# Altium project MatriXDeck.PrjPcb
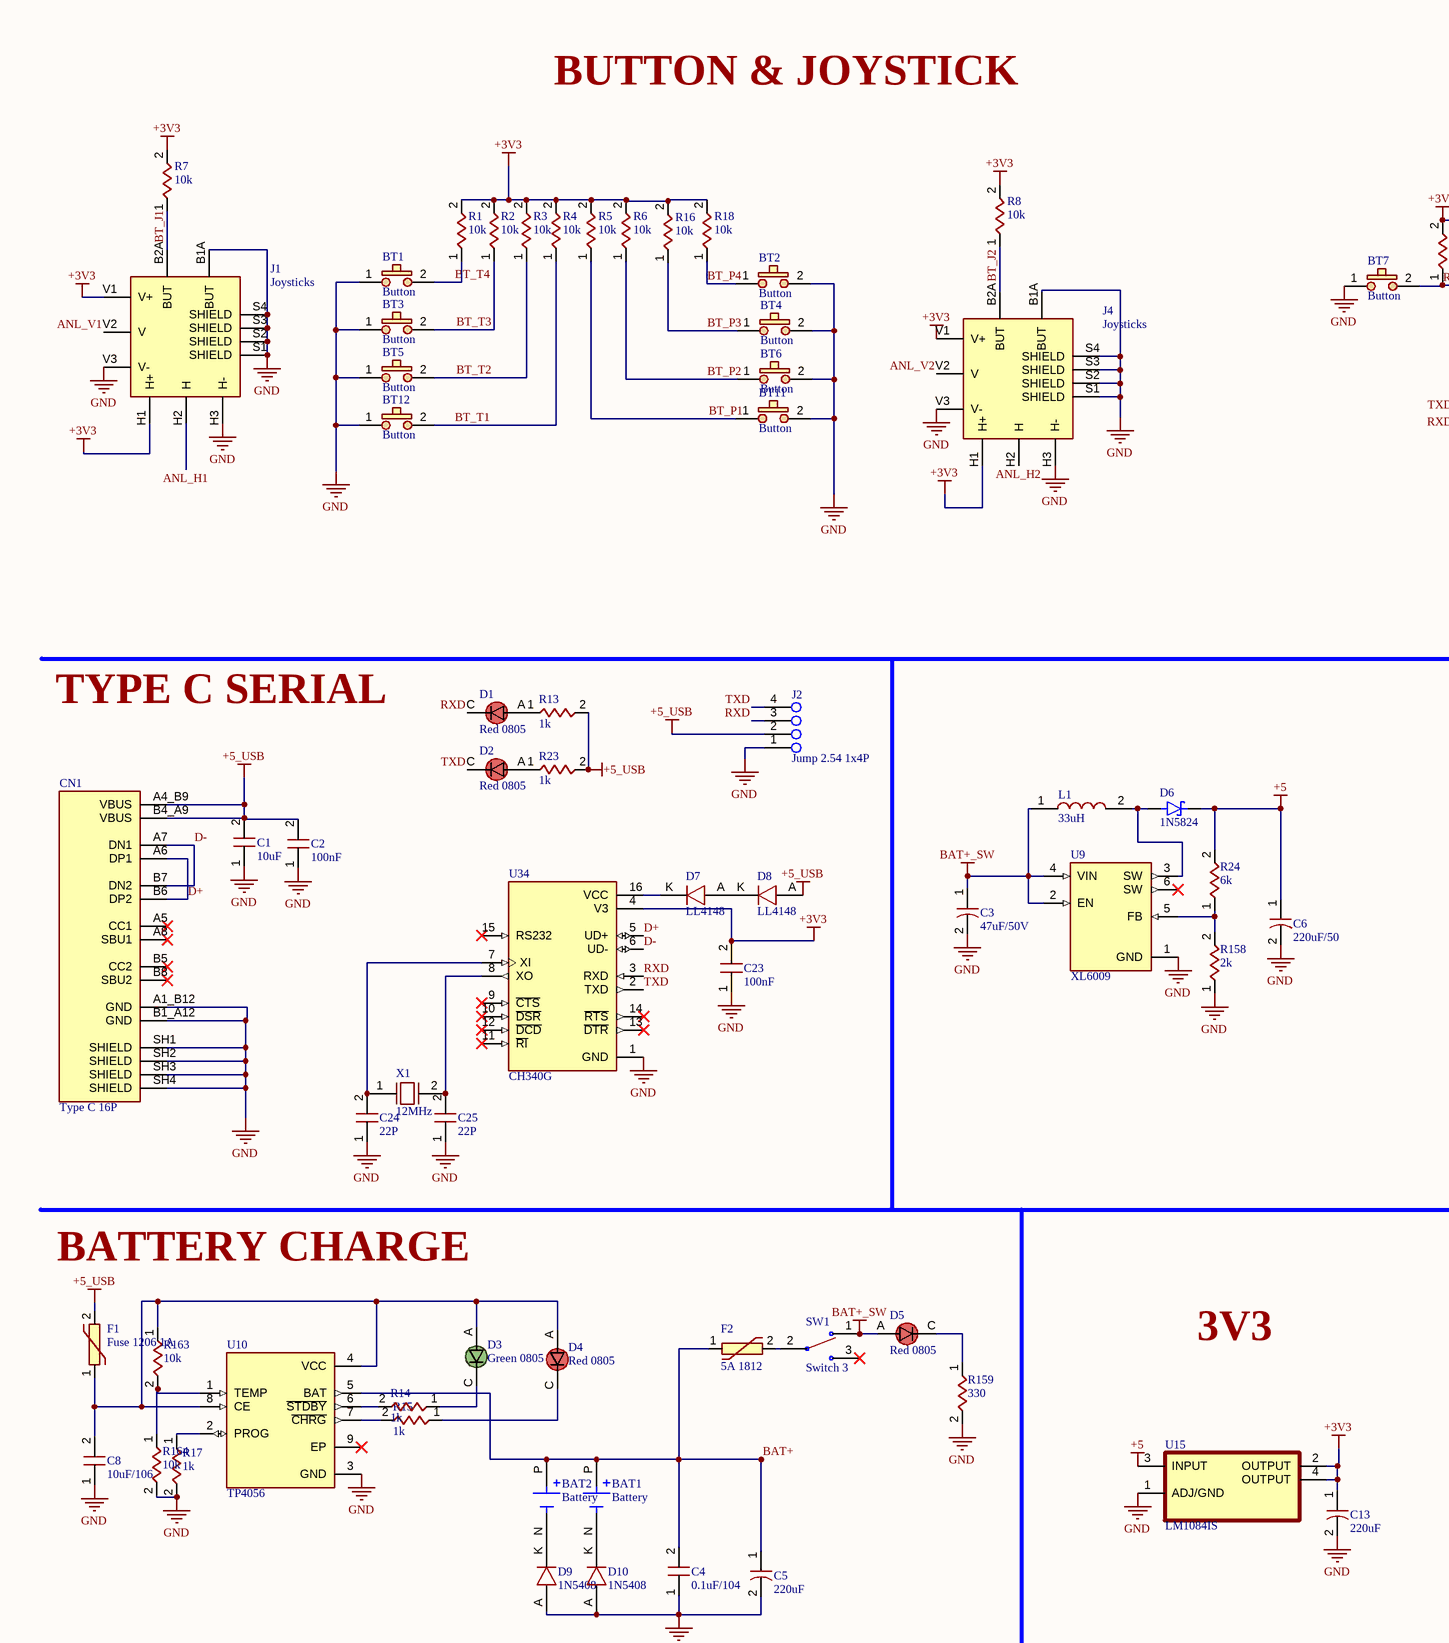
[diagram p0: MatriXDeck.SchDoc, top left]
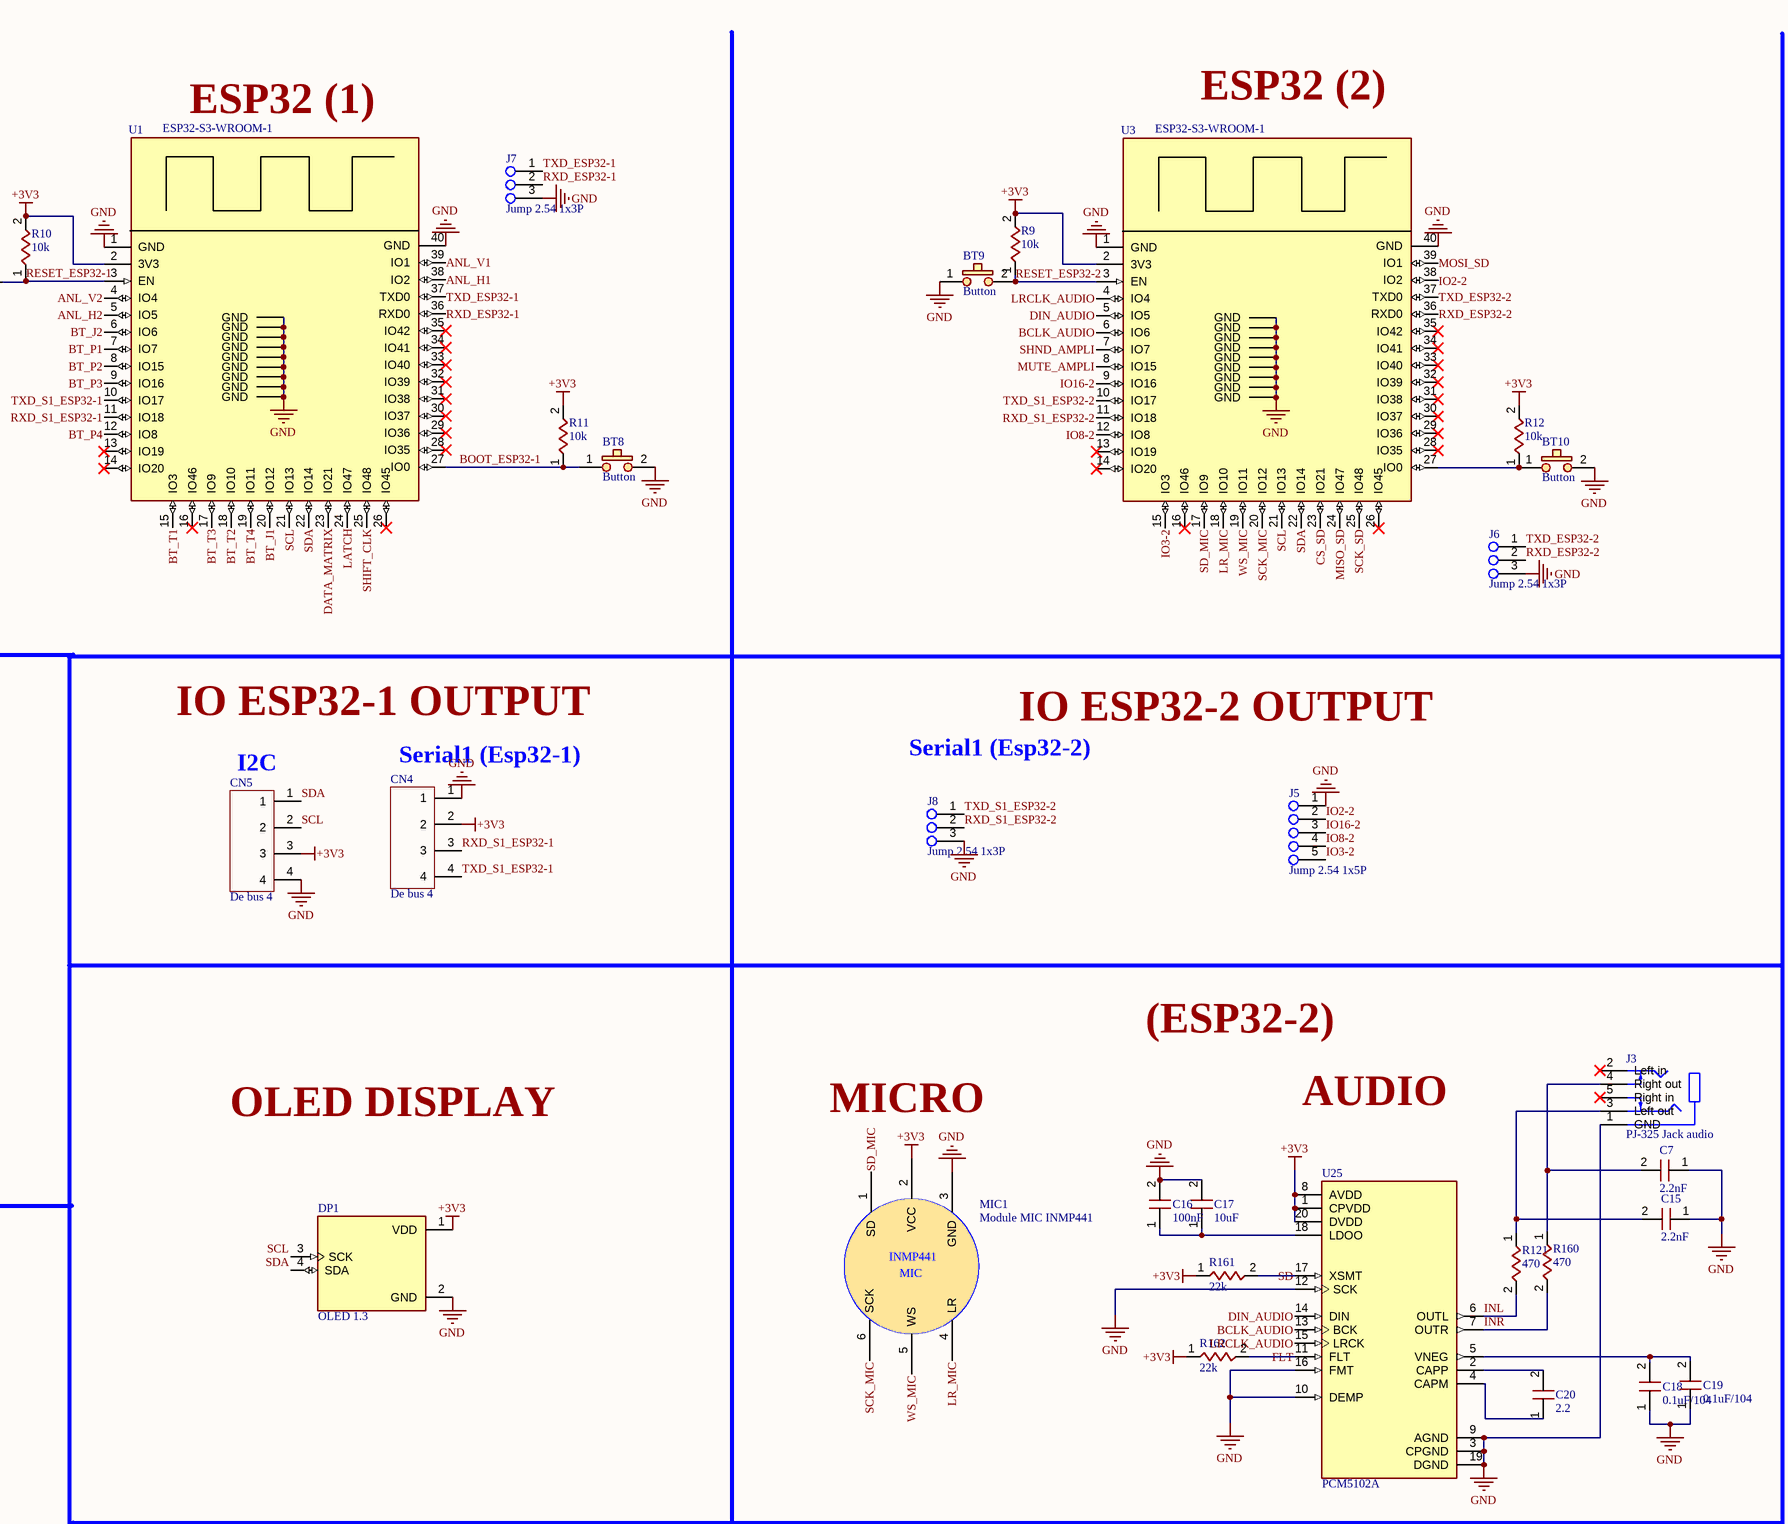
[diagram p1: MatriXDeck.SchDoc, top middle]
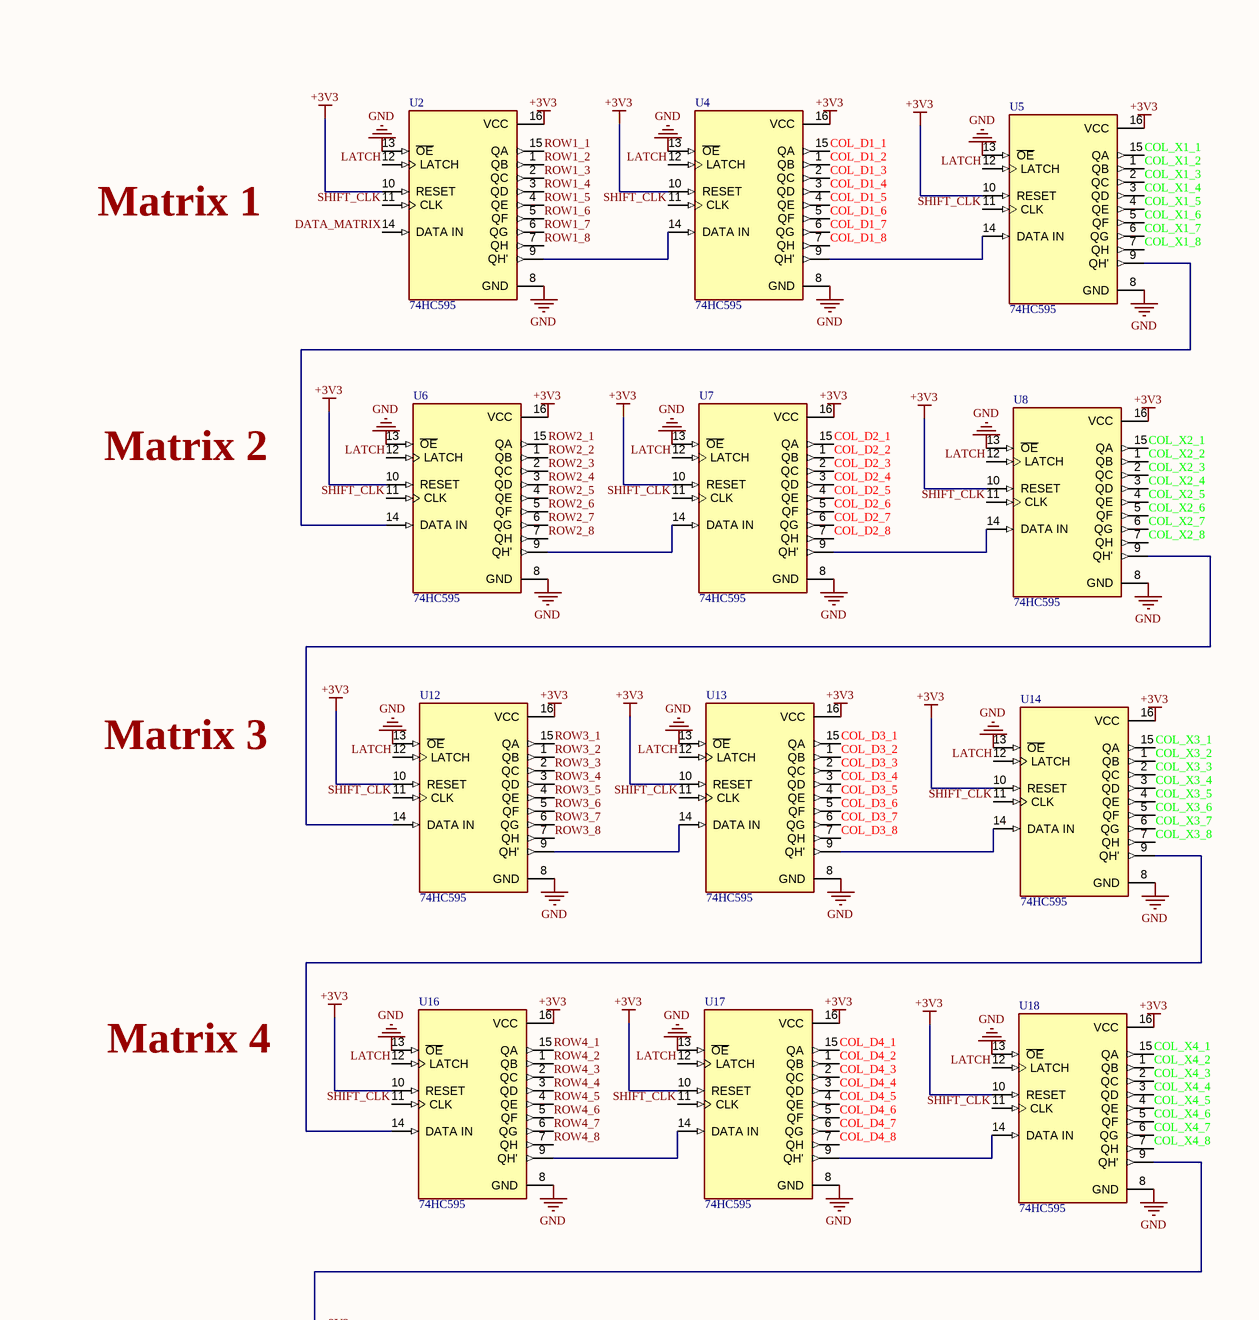
[diagram p2: MatriXDeck.SchDoc, top right]
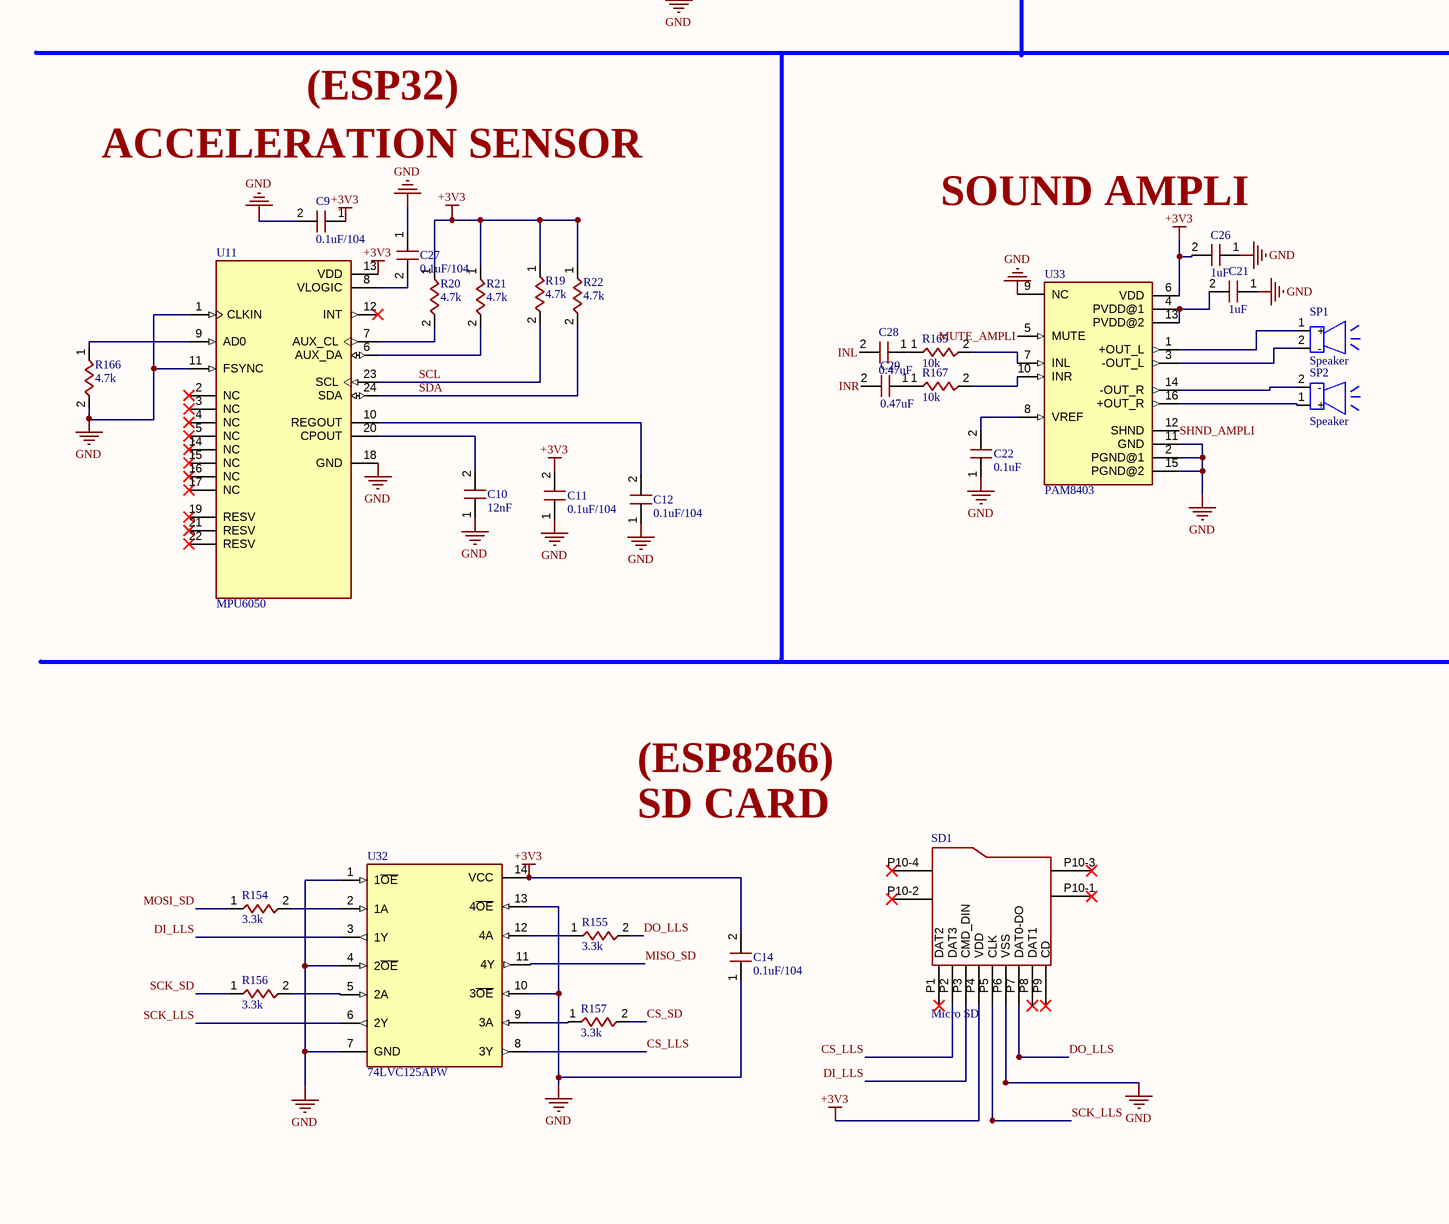
[diagram p3: MatriXDeck.SchDoc, bottom left]
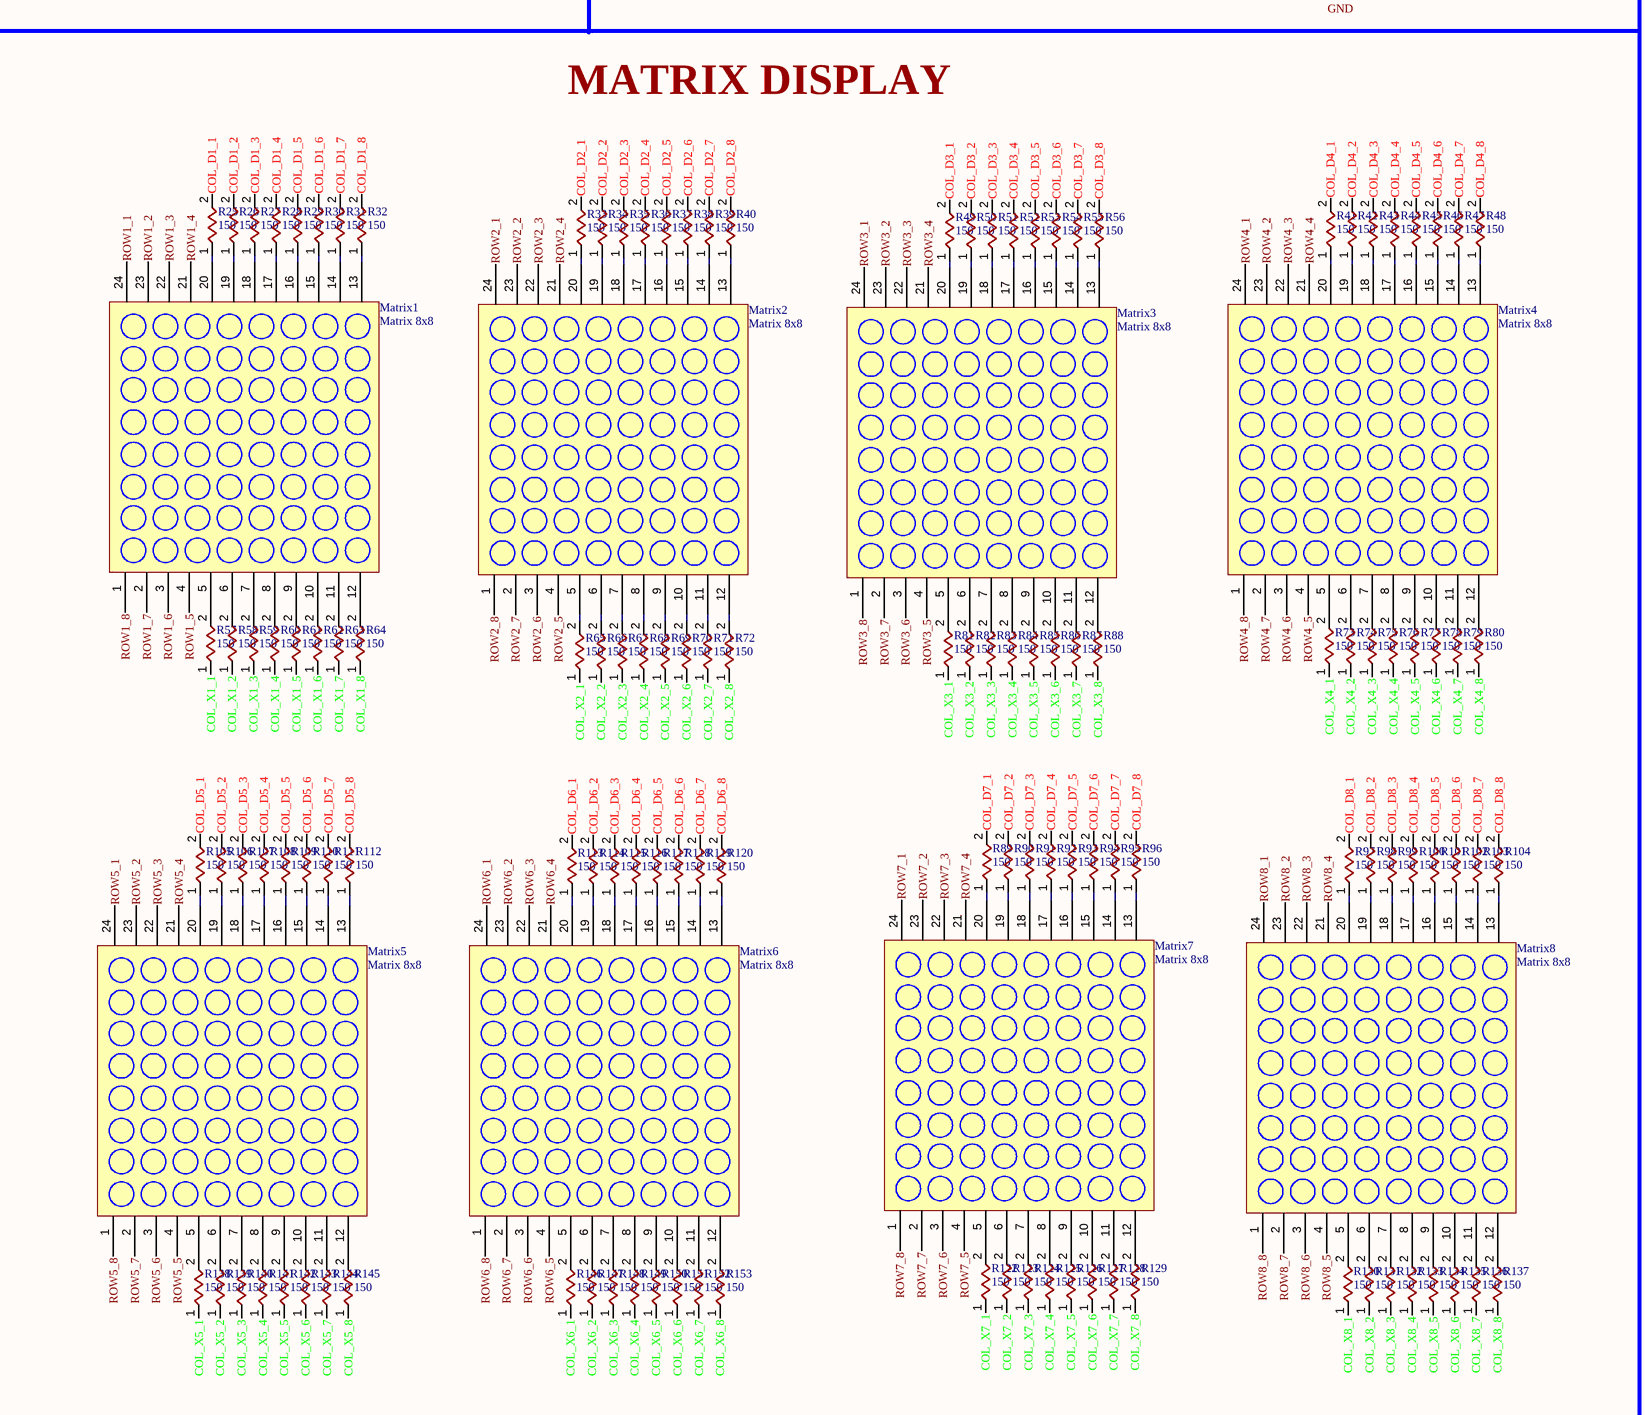
[diagram p4: MatriXDeck.SchDoc, bottom middle]
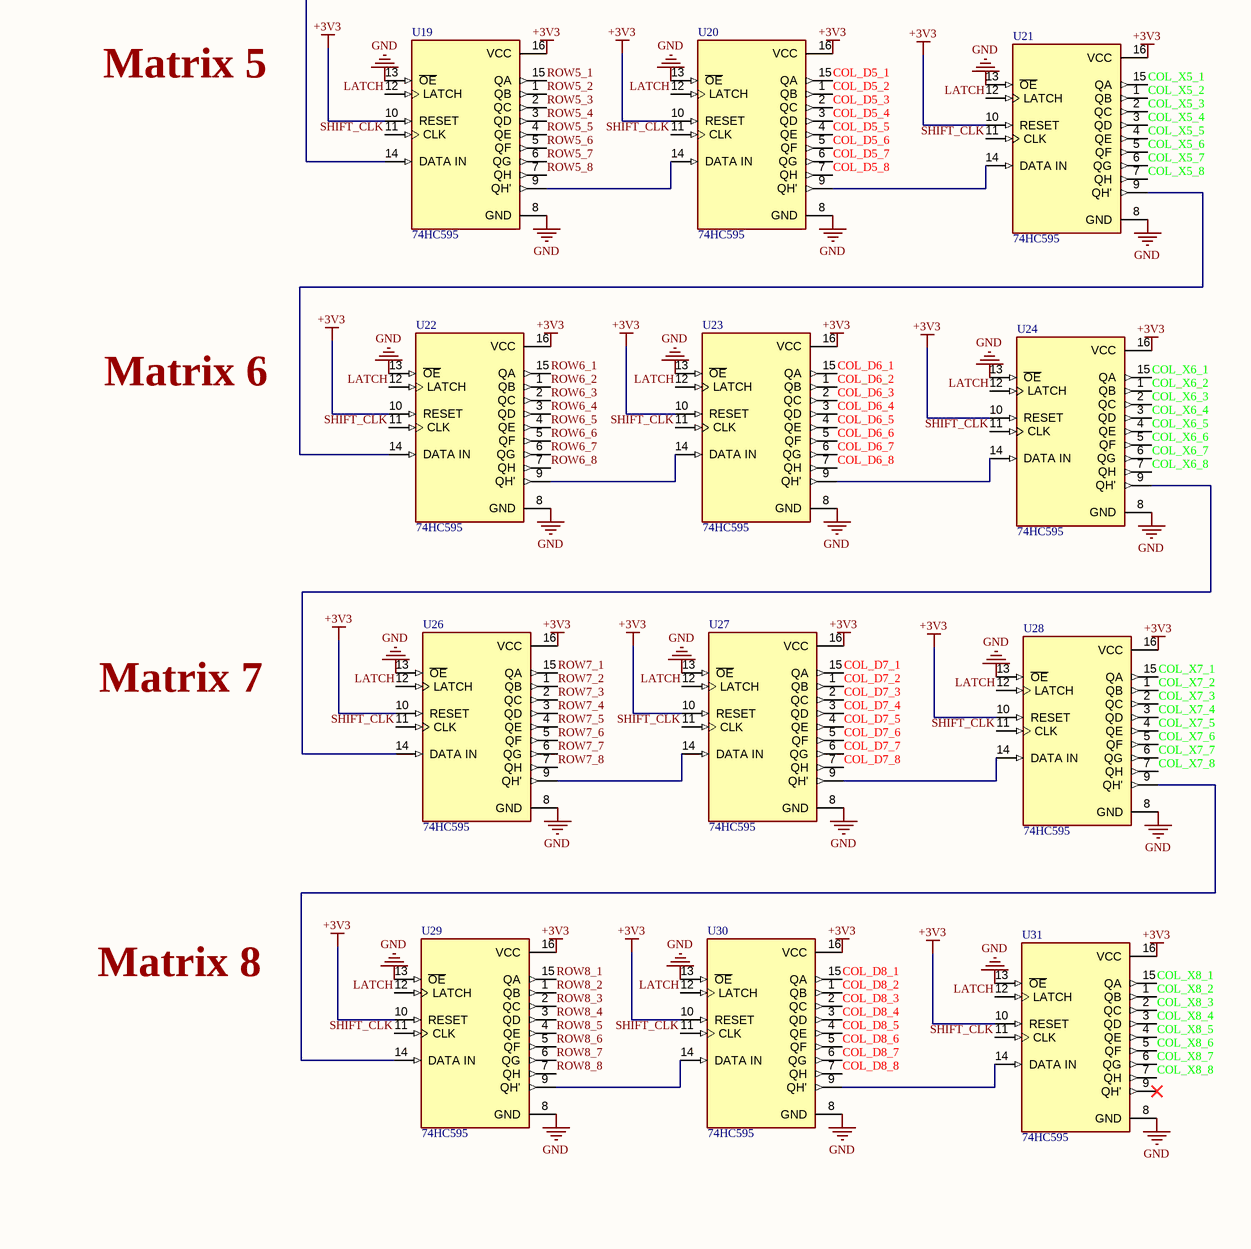
[diagram p5: MatriXDeck.SchDoc, bottom right]
1 sheet, 283 parts. Net scope: global (net labels, ports and power ports of the same name join across sheets).
Board file: MatrixDeck_Final.PcbDoc

## Sheet MatriXDeck.SchDoc
size 863 x 558 mm; SheetNumber: 1; SheetTotal: 1

### Parts
BAT1  Battery  [16850 SMD]
BAT2  Battery  [16850 SMD]
BT1  Button  [BT 12x12 SMD]
BT2  Button  [BT 12x12 SMD]
BT3  Button  [BT 12x12 SMD]
BT4  Button  [BT 12x12 SMD]
BT5  Button  [BT 12x12 SMD]
BT6  Button  [BT 12x12 SMD]
BT7  Button  [BT 6x4mm]
BT8  Button  [BT 6x4mm]
BT9  Button  [BT 6x4mm]
BT10  Button  [BT 6x4mm]
BT11  Button  [BT 12x12 SMD]
BT12  Button  [BT 12x12 SMD]
C1  10uF  [CAP 0805]
C2  100nF  [CAP 0805]
C3  47uF/50V  [Cap Alu 6.3x7.7]
C4  0.1uF/104  [CAP 0805]
C5  220uF  [Cap Alu 6.3x7.7]
C6  220uF/50  [Cap Alu 6.3x7.7]
C7  2.2nF  [CAP 0805]
C8  10uF/106  [CAP 0805]
C9  0.1uF/104  [CAP 0805]
C10  12nF  [CAP 0805]
C11  0.1uF/104  [CAP 0805]
C12  0.1uF/104  [CAP 0805]
C13  220uF  [Cap Alu 6.3x7.7]
C14  0.1uF/104  [CAP 0805]
C15  2.2nF  [CAP 0805]
C16  100nF  [CAP 0805]
C17  10uF  [CAP 0805]
C18  0.1uF/104  [CAP 0805]
C19  0.1uF/104  [CAP 0805]
C20  2.2  [CAP 0805]
C21  1uF  [CAP 0805]
C22  0.1uF  [CAP 0805]
C23  100nF  [CAP 0805]
C24  22P  [CAP 0805]
C25  22P  [CAP 0805]
C26  1uF  [CAP 0805]
C27  0.1uF/104  [CAP 0805]
C28  0.47uF  [CAP 0805]
C29  0.47uF  [CAP 0805]
CN1  Type C 16P  [Type C 16P]
CN4  De bus 4  [De bus 4]
CN5  De bus 4  [De bus 4]
D1  Red 0805  [LED RED 0805]
D2  Red 0805  [LED RED 0805]
D3  Green 0805  [LED GREEN 0805]
D4  Red 0805  [LED RED 0805]
D5  Red 0805  [LED RED 0805]
D6  1N5824  [DO-214AC (SMA)]
D7  LL4148  [DIO_LL4148]
D8  LL4148  [DIO_LL4148]
D9  1N5408  [S3M]
D10  1N5408  [S3M]
DP1  OLED 1.3  [Display OLED 1.3]
F1  Fuse 1206 1A  [Fuse 1206]
F2  5A 1812  [FUSE1812]
J1  Joysticks  [Joysticks]
J2  Jump 2.54 1x4P  [Jump 2.54 1x4P duc thang]
J3  PJ-325 Jack audio  [Jack audio PJ-325]
J4  Joysticks  [Joysticks]
J5  Jump 2.54 1x5P  [Jump 2.54 1x5P duc thang]
J6  Jump 2.54 1x3P  [Jump 2.54 1x3P duc thang]
J7  Jump 2.54 1x3P  [Jump 2.54 1x3P duc thang]
J8  Jump 2.54 1x3P  [Jump 2.54 1x3P duc thang]
L1  33uH  [Inductor 12x12 smd]
Matrix1  Matrix 8x8  [Matrix 8x8 2 color]
Matrix2  Matrix 8x8  [Matrix 8x8 2 color]
Matrix3  Matrix 8x8  [Matrix 8x8 2 color]
Matrix4  Matrix 8x8  [Matrix 8x8 2 color]
Matrix5  Matrix 8x8  [Matrix 8x8 2 color]
Matrix6  Matrix 8x8  [Matrix 8x8 2 color]
Matrix7  Matrix 8x8  [Matrix 8x8 2 color]
Matrix8  Matrix 8x8  [Matrix 8x8 2 color]
MIC1  Module MIC INMP441  [Module Mic INMP441]
R1  10k  [RES 0805]
R2  10k  [RES 0805]
R3  10k  [RES 0805]
R4  10k  [RES 0805]
R5  10k  [RES 0805]
R6  10k  [RES 0805]
R7  10k  [RES 0805]
R8  10k  [RES 0805]
R9  10k  [RES 0805]
R10  10k  [RES 0805]
R11  10k  [RES 0805]
R12  10k  [RES 0805]
R13  1k  [RES 0805]
R14  1k  [RES 0805]
R15  1k  [RES 0805]
R16  10k  [RES 0805]
R17  1k  [RES 0805]
R18  10k  [RES 0805]
R19  4.7k  [RES 0805]
R20  4.7k  [RES 0805]
R21  4.7k  [RES 0805]
R22  4.7k  [RES 0805]
R23  1k  [RES 0805]
R24  6k  [RES 0805]
R25  150  [RES 0805]
R26  150  [RES 0805]
R27  150  [RES 0805]
R28  150  [RES 0805]
R29  150  [RES 0805]
R30  150  [RES 0805]
R31  150  [RES 0805]
R32  150  [RES 0805]
R33  150  [RES 0805]
R34  150  [RES 0805]
R35  150  [RES 0805]
R36  150  [RES 0805]
R37  150  [RES 0805]
R38  150  [RES 0805]
R39  150  [RES 0805]
R40  150  [RES 0805]
R41  150  [RES 0805]
R42  150  [RES 0805]
R43  150  [RES 0805]
R44  150  [RES 0805]
R45  150  [RES 0805]
R46  150  [RES 0805]
R47  150  [RES 0805]
R48  150  [RES 0805]
R49  150  [RES 0805]
R50  150  [RES 0805]
R51  150  [RES 0805]
R52  150  [RES 0805]
R53  150  [RES 0805]
R54  150  [RES 0805]
R55  150  [RES 0805]
R56  150  [RES 0805]
R57  150  [RES 0805]
R58  150  [RES 0805]
R59  150  [RES 0805]
R60  150  [RES 0805]
R61  150  [RES 0805]
R62  150  [RES 0805]
R63  150  [RES 0805]
R64  150  [RES 0805]
R65  150  [RES 0805]
R66  150  [RES 0805]
R67  150  [RES 0805]
R68  150  [RES 0805]
R69  150  [RES 0805]
R70  150  [RES 0805]
R71  150  [RES 0805]
R72  150  [RES 0805]
R73  150  [RES 0805]
R74  150  [RES 0805]
R75  150  [RES 0805]
R76  150  [RES 0805]
R77  150  [RES 0805]
R78  150  [RES 0805]
R79  150  [RES 0805]
R80  150  [RES 0805]
R81  150  [RES 0805]
R82  150  [RES 0805]
R83  150  [RES 0805]
R84  150  [RES 0805]
R85  150  [RES 0805]
R86  150  [RES 0805]
R87  150  [RES 0805]
R88  150  [RES 0805]
R89  150  [RES 0805]
R90  150  [RES 0805]
R91  150  [RES 0805]
R92  150  [RES 0805]
R93  150  [RES 0805]
R94  150  [RES 0805]
R95  150  [RES 0805]
R96  150  [RES 0805]
R97  150  [RES 0805]
R98  150  [RES 0805]
R99  150  [RES 0805]
R100  150  [RES 0805]
R101  150  [RES 0805]
R102  150  [RES 0805]
R103  150  [RES 0805]
R104  150  [RES 0805]
R105  150  [RES 0805]
R106  150  [RES 0805]
R107  150  [RES 0805]
R108  150  [RES 0805]
R109  150  [RES 0805]
R110  150  [RES 0805]
R111  150  [RES 0805]
R112  150  [RES 0805]
R113  150  [RES 0805]
R114  150  [RES 0805]
R115  150  [RES 0805]
R116  150  [RES 0805]
R117  150  [RES 0805]
R118  150  [RES 0805]
R119  150  [RES 0805]
R120  150  [RES 0805]
R121  470  [RES 0805]
R122  150  [RES 0805]
R123  150  [RES 0805]
R124  150  [RES 0805]
R125  150  [RES 0805]
R126  150  [RES 0805]
R127  150  [RES 0805]
R128  150  [RES 0805]
R129  150  [RES 0805]
R130  150  [RES 0805]
R131  150  [RES 0805]
R132  150  [RES 0805]
R133  150  [RES 0805]
R134  150  [RES 0805]
R135  150  [RES 0805]
R136  150  [RES 0805]
R137  150  [RES 0805]
R138  150  [RES 0805]
R139  150  [RES 0805]
R140  150  [RES 0805]
R141  150  [RES 0805]
R142  150  [RES 0805]
R143  150  [RES 0805]
R144  150  [RES 0805]
R145  150  [RES 0805]
R146  150  [RES 0805]
R147  150  [RES 0805]
R148  150  [RES 0805]
R149  150  [RES 0805]
R150  150  [RES 0805]
R151  150  [RES 0805]
R152  150  [RES 0805]
R153  150  [RES 0805]
R154  3.3k  [RES 0805]
R155  3.3k  [RES 0805]
R156  3.3k  [RES 0805]
R157  3.3k  [RES 0805]
R158  2k  [RES 0805]
R159  330  [RES 0805]
R160  470  [RES 0805]
R161  22k  [RES 0805]
R162  22k  [RES 0805]
R163  10k  [RES 0805]
R164  10k  [RES 0805]
R165  10k  [RES 0805]
R166  4.7k  [RES 0805]
R167  10k  [RES 0805]
SD1  Micro SD  [TF Micro SD]
SP1  Speaker  [Speaker 2W 35x25]
SP2  Speaker  [Speaker 2W 35x25]
SW1  Switch 3  [Switch 3P SK12D07VG4]
U1  ESP32-S3-WROOM-1  [ESP32-S3]
U2  74HC595  [SOIC-16]
U3  ESP32-S3-WROOM-1  [ESP32-S3]
U4  74HC595  [SOIC-16]
U5  74HC595  [SOIC-16]
U6  74HC595  [SOIC-16]
U7  74HC595  [SOIC-16]
U8  74HC595  [SOIC-16]
U9  XL6009  [TO-263-5L]
U10  TP4056  [ESOP8]
U11  MPU6050  [QFN-24]
U12  74HC595  [SOIC-16]
U13  74HC595  [SOIC-16]
U14  74HC595  [SOIC-16]
U15  LM1084IS  [TO-263]
U16  74HC595  [SOIC-16]
U17  74HC595  [SOIC-16]
U18  74HC595  [SOIC-16]
U19  74HC595  [SOIC-16]
U20  74HC595  [SOIC-16]
U21  74HC595  [SOIC-16]
U22  74HC595  [SOIC-16]
U23  74HC595  [SOIC-16]
U24  74HC595  [SOIC-16]
U25  PCM5102A  [TSSOP-20]
U26  74HC595  [SOIC-16]
U27  74HC595  [SOIC-16]
U28  74HC595  [SOIC-16]
U29  74HC595  [SOIC-16]
U30  74HC595  [SOIC-16]
U31  74HC595  [SOIC-16]
U32  74LVC125APW  [TSSOP-14]
U33  PAM8403  [SOP-16]
U34  CH340G  [CH340G]
X1  12MHz  [Crytal SMD]

### Nets
+3V3: C9.1 C11.2 C13.1 C14.2 C23.2 C26.2 CN4.2 CN5.3 DP1.1(VDD) J1.H1(H+) J1.V1(V+) J4.H1(H+) J4.V1(V+) MIC1.2(VCC) R1.2 R2.2 R3.2 R4.2 R5.2 R6.2 R7.2 R8.2 R9.2 R10.2 R11.2 R12.2 R16.2 R18.2 R19.1 R20.1 R21.1 R22.1 R161.1 R162.1 SD1.P4(VDD) U1.2(3V3) U2.10(RESET) U2.16(VCC) U3.2(3V3) U4.10(RESET) U4.16(VCC) U5.10(RESET) U5.16(VCC) U6.10(RESET) U6.16(VCC) U7.10(RESET) U7.16(VCC) U8.10(RESET) U8.16(VCC) U11.13(VDD) U12.10(RESET) U12.16(VCC) U13.10(RESET) U13.16(VCC) U14.10(RESET) U14.16(VCC) U15.2(OUTPUT) U15.4(OUTPUT) U16.10(RESET) U16.16(VCC) U17.10(RESET) U17.16(VCC) U18.10(RESET) U18.16(VCC) U19.10(RESET) U19.16(VCC) U20.10(RESET) U20.16(VCC) U21.10(RESET) U21.16(VCC) U22.10(RESET) U22.16(VCC) U23.10(RESET) U23.16(VCC) U24.10(RESET) U24.16(VCC) U25.1(CPVDD) U25.8(AVDD) U25.20(DVDD) U26.10(RESET) U26.16(VCC) U27.10(RESET) U27.16(VCC) U28.10(RESET) U28.16(VCC) U29.10(RESET) U29.16(VCC) U30.10(RESET) U30.16(VCC) U31.10(RESET) U31.16(VCC) U32.14(VCC) U33.6(VDD) U34.4(V3)
+5: C6.1 D6.K R24.2 U15.3(INPUT)
+5_USB: C1.2 C2.2 CN1.A4_B9(VBUS) CN1.B4_A9(VBUS) D8.A F1.2 J2.2 R13.2 R23.2
BAT+_SW: C3.1 D5.A L1.1 SW1.1 U9.2(EN) U9.4(VIN)
GND: BT1.1 BT2.2 BT3.1 BT4.2 BT5.1 BT6.2 BT7.1 BT8.2 BT9.1 BT10.2 BT11.2 BT12.1 C1.1 C2.1 C3.2 C4.1 C5.2 C6.2 C7.1 C8.1 C9.2 C10.1 C11.1 C12.1 C13.2 C14.1 C15.1 C16.2 C17.2 C18.1 C19.1 C21.1 C22.1 C23.1 C24.1 C25.1 C26.1 C27.1 CN1.A1_B12(GND) CN1.B1_A12(GND) CN1.SH1(SHIELD) CN1.SH2(SHIELD) CN1.SH3(SHIELD) CN1.SH4(SHIELD) CN4.1 CN5.4 D9.A D10.A DP1.2(GND) J1.B1A(BUT) J1.H3(H-) J1.S1(SHIELD) J1.S2(SHIELD) J1.S3(SHIELD) J1.S4(SHIELD) J1.V3(V-) J2.1 J3.1(GND) J4.B1A(BUT) J4.H3(H-) J4.S1(SHIELD) J4.S2(SHIELD) J4.S3(SHIELD) J4.S4(SHIELD) J4.V3(V-) J5.1 J6.3 J7.3 J8.3 MIC1.3(GND) R17.2 R158.1 R159.2 R164.2 R166.2 SD1.P6(VSS) U1.1(GND) U1.40(GND) U1.41_1(GND) U1.41_2(GND) U1.41_3(GND) U1.41_4(GND) U1.41_5(GND) U1.41_6(GND) U1.41_7(GND) U1.41_8(GND) U1.41_9(GND) U2.8(GND) U2.13(~{OE}) U3.1(GND) U3.40(GND) U3.41_1(GND) U3.41_2(GND) U3.41_3(GND) U3.41_4(GND) U3.41_5(GND) U3.41_6(GND) U3.41_7(GND) U3.41_8(GND) U3.41_9(GND) U4.8(GND) U4.13(~{OE}) U5.8(GND) U5.13(~{OE}) U6.8(GND) U6.13(~{OE}) U7.8(GND) U7.13(~{OE}) U8.8(GND) U8.13(~{OE}) U9.1(GND) U10.3(GND) U11.1(CLKIN) U11.11(FSYNC) U11.18(GND) U12.8(GND) U12.13(~{OE}) U13.8(GND) U13.13(~{OE}) U14.8(GND) U14.13(~{OE}) U15.1(ADJ/GND) U16.8(GND) U16.13(~{OE}) U17.8(GND) U17.13(~{OE}) U18.8(GND) U18.13(~{OE}) U19.8(GND) U19.13(~{OE}) U20.8(GND) U20.13(~{OE}) U21.8(GND) U21.13(~{OE}) U22.8(GND) U22.13(~{OE}) U23.8(GND) U23.13(~{OE}) U24.8(GND) U24.13(~{OE}) U25.3(CPGND) U25.9(AGND) U25.10(DEMP) U25.12(SCK) U25.16(FMT) U25.19(DGND) U26.8(GND) U26.13(~{OE}) U27.8(GND) U27.13(~{OE}) U28.8(GND) U28.13(~{OE}) U29.8(GND) U29.13(~{OE}) U30.8(GND) U30.13(~{OE}) U31.8(GND) U31.13(~{OE}) U32.1(1~{OE}) U32.4(2~{OE}) U32.7(GND) U32.10(3~{OE}) U32.13(4~{OE}) U33.2(PGND@1) U33.9(NC) U33.11(GND) U33.15(PGND@2) U34.1(GND)
ANL_H1: J1.H2(H) U1.38(IO2)
ANL_H2: J4.H2(H) U1.5(IO5)
ANL_V1: J1.V2(V) U1.39(IO1)
ANL_V2: J4.V2(V) U1.4(IO4)
BAT+: BAT1.P(POS) BAT2.P(POS) C4.2 C5.1 F2.1 U10.5(BAT)
BCLK_AUDIO: U3.6(IO6) U25.13(BCK)
BOOT_ESP32-1: BT8.1 R11.1 U1.27(IO0)
BT_J1: J1.B2A(BUT) R7.1 U1.20(IO12)
BT_J2: J4.B2A(BUT) R8.1 U1.6(IO6)
BT_P1: BT11.1 R5.1 U1.7(IO7)
BT_P2: BT6.1 R6.1 U1.8(IO15)
BT_P3: BT4.1 R16.1 U1.9(IO16)
BT_P4: BT2.1 R18.1 U1.12(IO8)
BT_T1: BT12.2 R4.1 U1.15(IO3)
BT_T2: BT5.2 R3.1 U1.18(IO10)
BT_T3: BT3.2 R2.1 U1.17(IO9)
BT_T4: BT1.2 R1.1 U1.19(IO11)
COL_D1_1: R25.2 U4.15(QA)
COL_D1_2: R26.2 U4.1(QB)
COL_D1_3: R27.2 U4.2(QC)
COL_D1_4: R28.2 U4.3(QD)
COL_D1_5: R29.2 U4.4(QE)
COL_D1_6: R30.2 U4.5(QF)
COL_D1_7: R31.2 U4.6(QG)
COL_D1_8: R32.2 U4.7(QH)
COL_D2_1: R33.2 U7.15(QA)
COL_D2_2: R34.2 U7.1(QB)
COL_D2_3: R35.2 U7.2(QC)
COL_D2_4: R36.2 U7.3(QD)
COL_D2_5: R37.2 U7.4(QE)
COL_D2_6: R38.2 U7.5(QF)
COL_D2_7: R39.2 U7.6(QG)
COL_D2_8: R40.2 U7.7(QH)
COL_D3_1: R49.2 U13.15(QA)
COL_D3_2: R50.2 U13.1(QB)
COL_D3_3: R51.2 U13.2(QC)
COL_D3_4: R52.2 U13.3(QD)
COL_D3_5: R53.2 U13.4(QE)
COL_D3_6: R54.2 U13.5(QF)
COL_D3_7: R55.2 U13.6(QG)
COL_D3_8: R56.2 U13.7(QH)
COL_D4_1: R41.2 U17.15(QA)
COL_D4_2: R42.2 U17.1(QB)
COL_D4_3: R43.2 U17.2(QC)
COL_D4_4: R44.2 U17.3(QD)
COL_D4_5: R45.2 U17.4(QE)
COL_D4_6: R46.2 U17.5(QF)
COL_D4_7: R47.2 U17.6(QG)
COL_D4_8: R48.2 U17.7(QH)
COL_D5_1: R105.2 U20.15(QA)
COL_D5_2: R106.2 U20.1(QB)
COL_D5_3: R107.2 U20.2(QC)
COL_D5_4: R108.2 U20.3(QD)
COL_D5_5: R109.2 U20.4(QE)
COL_D5_6: R110.2 U20.5(QF)
COL_D5_7: R111.2 U20.6(QG)
COL_D5_8: R112.2 U20.7(QH)
COL_D6_1: R113.2 U23.15(QA)
COL_D6_2: R114.2 U23.1(QB)
COL_D6_3: R115.2 U23.2(QC)
COL_D6_4: R116.2 U23.3(QD)
COL_D6_5: R117.2 U23.4(QE)
COL_D6_6: R118.2 U23.5(QF)
COL_D6_7: R119.2 U23.6(QG)
COL_D6_8: R120.2 U23.7(QH)
COL_D7_1: R89.2 U27.15(QA)
COL_D7_2: R90.2 U27.1(QB)
COL_D7_3: R91.2 U27.2(QC)
COL_D7_4: R92.2 U27.3(QD)
COL_D7_5: R93.2 U27.4(QE)
COL_D7_6: R94.2 U27.5(QF)
COL_D7_7: R95.2 U27.6(QG)
COL_D7_8: R96.2 U27.7(QH)
COL_D8_1: R97.2 U30.15(QA)
COL_D8_2: R98.2 U30.1(QB)
COL_D8_3: R99.2 U30.2(QC)
COL_D8_4: R100.2 U30.3(QD)
COL_D8_5: R101.2 U30.4(QE)
COL_D8_6: R102.2 U30.5(QF)
COL_D8_7: R103.2 U30.6(QG)
COL_D8_8: R104.2 U30.7(QH)
COL_X1_1: R57.1 U5.15(QA)
COL_X1_2: R58.1 U5.1(QB)
COL_X1_3: R59.1 U5.2(QC)
COL_X1_4: R60.1 U5.3(QD)
COL_X1_5: R61.1 U5.4(QE)
COL_X1_6: R62.1 U5.5(QF)
COL_X1_7: R63.1 U5.6(QG)
COL_X1_8: R64.1 U5.7(QH)
COL_X2_1: R65.1 U8.15(QA)
COL_X2_2: R66.1 U8.1(QB)
COL_X2_3: R67.1 U8.2(QC)
COL_X2_4: R68.1 U8.3(QD)
COL_X2_5: R69.1 U8.4(QE)
COL_X2_6: R70.1 U8.5(QF)
COL_X2_7: R71.1 U8.6(QG)
COL_X2_8: R72.1 U8.7(QH)
COL_X3_1: R81.1 U14.15(QA)
COL_X3_2: R82.1 U14.1(QB)
COL_X3_3: R83.1 U14.2(QC)
COL_X3_4: R84.1 U14.3(QD)
COL_X3_5: R85.1 U14.4(QE)
COL_X3_6: R86.1 U14.5(QF)
COL_X3_7: R87.1 U14.6(QG)
COL_X3_8: R88.1 U14.7(QH)
COL_X4_1: R73.1 U18.15(QA)
COL_X4_2: R74.1 U18.1(QB)
COL_X4_3: R75.1 U18.2(QC)
COL_X4_4: R76.1 U18.3(QD)
COL_X4_5: R77.1 U18.4(QE)
COL_X4_6: R78.1 U18.5(QF)
COL_X4_7: R79.1 U18.6(QG)
COL_X4_8: R80.1 U18.7(QH)
COL_X5_1: R138.1 U21.15(QA)
COL_X5_2: R139.1 U21.1(QB)
COL_X5_3: R140.1 U21.2(QC)
COL_X5_4: R141.1 U21.3(QD)
COL_X5_5: R142.1 U21.4(QE)
COL_X5_6: R143.1 U21.5(QF)
COL_X5_7: R144.1 U21.6(QG)
COL_X5_8: R145.1 U21.7(QH)
COL_X6_1: R146.1 U24.15(QA)
COL_X6_2: R147.1 U24.1(QB)
COL_X6_3: R148.1 U24.2(QC)
COL_X6_4: R149.1 U24.3(QD)
COL_X6_5: R150.1 U24.4(QE)
COL_X6_6: R151.1 U24.5(QF)
COL_X6_7: R152.1 U24.6(QG)
COL_X6_8: R153.1 U24.7(QH)
COL_X7_1: R122.1 U28.15(QA)
COL_X7_2: R123.1 U28.1(QB)
COL_X7_3: R124.1 U28.2(QC)
COL_X7_4: R125.1 U28.3(QD)
COL_X7_5: R126.1 U28.4(QE)
COL_X7_6: R127.1 U28.5(QF)
COL_X7_7: R128.1 U28.6(QG)
COL_X7_8: R129.1 U28.7(QH)
COL_X8_1: R130.1 U31.15(QA)
COL_X8_2: R131.1 U31.1(QB)
COL_X8_3: R132.1 U31.2(QC)
COL_X8_4: R133.1 U31.3(QD)
COL_X8_5: R134.1 U31.4(QE)
COL_X8_6: R135.1 U31.5(QF)
COL_X8_7: R136.1 U31.6(QG)
COL_X8_8: R137.1 U31.7(QH)
CS_LLS: SD1.P2(DAT3) U32.8(3Y)
CS_SD: R157.2 U3.23(IO21)
D+: CN1.A6(DP1) CN1.B6(DP2) U34.5(UD+)
D-: CN1.A7(DN1) CN1.B7(DN2) U34.6(UD-)
DATA_MATRIX: U1.23(IO21) U2.14(DATA_IN)
DI_LLS: SD1.P3(CMD_DIN) U32.3(1Y)
DIN_AUDIO: U3.5(IO5) U25.14(DIN)
DO_LLS: R155.2 SD1.P7(DAT0-DO)
FLT: R162.2 U25.11(FLT)
INL: C28.2 R121.2 U25.6(OUTL)
INR: C29.2 R160.2 U25.7(OUTR)
IO2-2: J5.2 U3.38(IO2)
IO3-2: J5.5 U3.15(IO3)
IO8-2: J5.4 U3.12(IO8)
IO16-2: J5.3 U3.9(IO16)
LATCH: U1.24(IO47) U2.12(LATCH) U4.12(LATCH) U5.12(LATCH) U6.12(LATCH) U7.12(LATCH) U8.12(LATCH) U12.12(LATCH) U13.12(LATCH) U14.12(LATCH) U16.12(LATCH) U17.12(LATCH) U18.12(LATCH) U19.12(LATCH) U20.12(LATCH) U21.12(LATCH) U22.12(LATCH) U23.12(LATCH) U24.12(LATCH) U26.12(LATCH) U27.12(LATCH) U28.12(LATCH) U29.12(LATCH) U30.12(LATCH) U31.12(LATCH)
LR_MIC: MIC1.4(LR) U3.18(IO10)
LRCLK_AUDIO: U3.4(IO4) U25.15(LRCK)
MISO_SD: U3.24(IO47) U32.11(4Y)
MOSI_SD: R154.1 U3.39(IO1)
MUTE_AMPLI: U3.8(IO15) U33.5(MUTE)
RESET_ESP32-1: BT7.2 R10.1 U1.3(EN)
RESET_ESP32-2: BT9.2 R9.1 U3.3(EN)
ROW1_1: Matrix1.24 U2.15(QA)
ROW1_2: Matrix1.23 U2.1(QB)
ROW1_3: Matrix1.22 U2.2(QC)
ROW1_4: Matrix1.21 U2.3(QD)
ROW1_5: Matrix1.4 U2.4(QE)
ROW1_6: Matrix1.3 U2.5(QF)
ROW1_7: Matrix1.2 U2.6(QG)
ROW1_8: Matrix1.1 U2.7(QH)
ROW2_1: Matrix2.24 U6.15(QA)
ROW2_2: Matrix2.23 U6.1(QB)
ROW2_3: Matrix2.22 U6.2(QC)
ROW2_4: Matrix2.21 U6.3(QD)
ROW2_5: Matrix2.4 U6.4(QE)
ROW2_6: Matrix2.3 U6.5(QF)
ROW2_7: Matrix2.2 U6.6(QG)
ROW2_8: Matrix2.1 U6.7(QH)
ROW3_1: Matrix3.24 U12.15(QA)
ROW3_2: Matrix3.23 U12.1(QB)
ROW3_3: Matrix3.22 U12.2(QC)
ROW3_4: Matrix3.21 U12.3(QD)
ROW3_5: Matrix3.4 U12.4(QE)
ROW3_6: Matrix3.3 U12.5(QF)
ROW3_7: Matrix3.2 U12.6(QG)
ROW3_8: Matrix3.1 U12.7(QH)
ROW4_1: Matrix4.24 U16.15(QA)
ROW4_2: Matrix4.23 U16.1(QB)
ROW4_3: Matrix4.22 U16.2(QC)
ROW4_4: Matrix4.21 U16.3(QD)
ROW4_5: Matrix4.4 U16.4(QE)
ROW4_6: Matrix4.3 U16.5(QF)
ROW4_7: Matrix4.2 U16.6(QG)
ROW4_8: Matrix4.1 U16.7(QH)
ROW5_1: Matrix5.24 U19.15(QA)
ROW5_2: Matrix5.23 U19.1(QB)
ROW5_3: Matrix5.22 U19.2(QC)
ROW5_4: Matrix5.21 U19.3(QD)
ROW5_5: Matrix5.4 U19.4(QE)
ROW5_6: Matrix5.3 U19.5(QF)
ROW5_7: Matrix5.2 U19.6(QG)
ROW5_8: Matrix5.1 U19.7(QH)
ROW6_1: Matrix6.24 U22.15(QA)
ROW6_2: Matrix6.23 U22.1(QB)
ROW6_3: Matrix6.22 U22.2(QC)
ROW6_4: Matrix6.21 U22.3(QD)
ROW6_5: Matrix6.4 U22.4(QE)
ROW6_6: Matrix6.3 U22.5(QF)
ROW6_7: Matrix6.2 U22.6(QG)
ROW6_8: Matrix6.1 U22.7(QH)
ROW7_1: Matrix7.24 U26.15(QA)
ROW7_2: Matrix7.23 U26.1(QB)
ROW7_3: Matrix7.22 U26.2(QC)
ROW7_4: Matrix7.21 U26.3(QD)
ROW7_5: Matrix7.4 U26.4(QE)
ROW7_6: Matrix7.3 U26.5(QF)
ROW7_7: Matrix7.2 U26.6(QG)
ROW7_8: Matrix7.1 U26.7(QH)
ROW8_1: Matrix8.24 U29.15(QA)
ROW8_2: Matrix8.23 U29.1(QB)
ROW8_3: Matrix8.22 U29.2(QC)
ROW8_4: Matrix8.21 U29.3(QD)
ROW8_5: Matrix8.4 U29.4(QE)
ROW8_6: Matrix8.3 U29.5(QF)
ROW8_7: Matrix8.2 U29.6(QG)
ROW8_8: Matrix8.1 U29.7(QH)
RXD: D1.C J2.3 U34.3(RXD)
RXD_ESP32-1: J7.2 U1.36(RXD0)
RXD_ESP32-2: J6.2 U3.36(RXD0)
RXD_S1_ESP32-1: CN4.3 U1.11(IO18)
RXD_S1_ESP32-2: J8.2 U3.11(IO18)
SCK_LLS: SD1.P5(CLK) U32.6(2Y)
SCK_MIC: MIC1.6(SCK) U3.20(IO12)
SCK_SD: R156.1 U3.25(IO48)
SCL: CN5.2 DP1.3(SCK) R19.2 U1.21(IO13) U3.21(IO13) U11.23(SCL)
SD: R161.2 U25.17(XSMT)
SD_MIC: MIC1.1(SD) U3.17(IO9)
SDA: CN5.1 DP1.4(SDA) R22.2 U1.22(IO14) U3.22(IO14) U11.24(SDA)
SHIFT_CLK: U1.25(IO48) U2.11(CLK) U4.11(CLK) U5.11(CLK) U6.11(CLK) U7.11(CLK) U8.11(CLK) U12.11(CLK) U13.11(CLK) U14.11(CLK) U16.11(CLK) U17.11(CLK) U18.11(CLK) U19.11(CLK) U20.11(CLK) U21.11(CLK) U22.11(CLK) U23.11(CLK) U24.11(CLK) U26.11(CLK) U27.11(CLK) U28.11(CLK) U29.11(CLK) U30.11(CLK) U31.11(CLK)
SHND_AMPLI: U3.7(IO7) U33.12(SHND)
TXD: D2.C J2.4 U34.2(TXD)
TXD_ESP32-1: J7.1 U1.37(TXD0)
TXD_ESP32-2: J6.1 U3.37(TXD0)
TXD_S1_ESP32-1: CN4.4 U1.10(IO17)
TXD_S1_ESP32-2: J8.1 U3.10(IO17)
WS_MIC: MIC1.5(WS) U3.19(IO11)
NetBAT1_N: BAT1.N(NEG) D10.K
NetBAT2_N: BAT2.N(NEG) D9.K
NetBT10_1: BT10.1 R12.1 U3.27(IO0)
NetC7_2: C7.2 J3.4(Right_out) R160.1
NetC8_2: C8.2 D3.A D4.A F1.1 R163.1 U10.4(VCC) U10.8(CE)
NetC10_2: C10.2 U11.20(CPOUT)
NetC12_2: C12.2 U11.10(REGOUT)
NetC15_2: C15.2 J3.3(Left_out) R121.1
NetC16_1: C16.1 C17.1 U25.18(LDOO)
NetC18_2: C18.2 C19.2 U25.5(VNEG)
NetC20_1: C20.1 U25.4(CAPM)
NetC20_2: C20.2 U25.2(CAPP)
NetC21_2: C21.2 U33.4(PVDD@1) U33.13(PVDD@2)
NetC22_2: C22.2 U33.8(VREF)
NetC24_2: C24.2 U34.7(XI) X1.1
NetC25_2: C25.2 U34.8(XO) X1.2
NetC27_2: C27.2 U11.8(VLOGIC)
NetC28_1: C28.1 R165.1
NetC29_1: C29.1 R167.1
NetD1_A: D1.A R13.1
NetD2_A: D2.A R23.1
NetD3_C: D3.C R14.1
NetD4_C: D4.C R15.1
NetD5_C: D5.C R159.1
NetD6_A: D6.A L1.2 U9.3(SW)
NetD7_A: D7.A D8.K
NetD7_K: D7.K U34.16(VCC)
NetF2_2: F2.2 SW1.2
NetMatrix1_5: Matrix1.5 R57.2
NetMatrix1_6: Matrix1.6 R58.2
NetMatrix1_7: Matrix1.7 R59.2
NetMatrix1_8: Matrix1.8 R60.2
NetMatrix1_9: Matrix1.9 R61.2
NetMatrix1_10: Matrix1.10 R62.2
NetMatrix1_11: Matrix1.11 R63.2
NetMatrix1_12: Matrix1.12 R64.2
NetMatrix1_13: Matrix1.13 R32.1
NetMatrix1_14: Matrix1.14 R31.1
NetMatrix1_15: Matrix1.15 R30.1
NetMatrix1_16: Matrix1.16 R29.1
NetMatrix1_17: Matrix1.17 R28.1
NetMatrix1_18: Matrix1.18 R27.1
NetMatrix1_19: Matrix1.19 R26.1
NetMatrix1_20: Matrix1.20 R25.1
NetMatrix2_5: Matrix2.5 R65.2
NetMatrix2_6: Matrix2.6 R66.2
NetMatrix2_7: Matrix2.7 R67.2
NetMatrix2_8: Matrix2.8 R68.2
NetMatrix2_9: Matrix2.9 R69.2
NetMatrix2_10: Matrix2.10 R70.2
NetMatrix2_11: Matrix2.11 R71.2
NetMatrix2_12: Matrix2.12 R72.2
NetMatrix2_13: Matrix2.13 R40.1
NetMatrix2_14: Matrix2.14 R39.1
NetMatrix2_15: Matrix2.15 R38.1
NetMatrix2_16: Matrix2.16 R37.1
NetMatrix2_17: Matrix2.17 R36.1
NetMatrix2_18: Matrix2.18 R35.1
NetMatrix2_19: Matrix2.19 R34.1
NetMatrix2_20: Matrix2.20 R33.1
NetMatrix3_5: Matrix3.5 R81.2
NetMatrix3_6: Matrix3.6 R82.2
NetMatrix3_7: Matrix3.7 R83.2
NetMatrix3_8: Matrix3.8 R84.2
NetMatrix3_9: Matrix3.9 R85.2
NetMatrix3_10: Matrix3.10 R86.2
NetMatrix3_11: Matrix3.11 R87.2
NetMatrix3_12: Matrix3.12 R88.2
NetMatrix3_13: Matrix3.13 R56.1
NetMatrix3_14: Matrix3.14 R55.1
NetMatrix3_15: Matrix3.15 R54.1
NetMatrix3_16: Matrix3.16 R53.1
NetMatrix3_17: Matrix3.17 R52.1
NetMatrix3_18: Matrix3.18 R51.1
NetMatrix3_19: Matrix3.19 R50.1
NetMatrix3_20: Matrix3.20 R49.1
NetMatrix4_5: Matrix4.5 R73.2
NetMatrix4_6: Matrix4.6 R74.2
NetMatrix4_7: Matrix4.7 R75.2
NetMatrix4_8: Matrix4.8 R76.2
NetMatrix4_9: Matrix4.9 R77.2
NetMatrix4_10: Matrix4.10 R78.2
NetMatrix4_11: Matrix4.11 R79.2
NetMatrix4_12: Matrix4.12 R80.2
NetMatrix4_13: Matrix4.13 R48.1
NetMatrix4_14: Matrix4.14 R47.1
NetMatrix4_15: Matrix4.15 R46.1
NetMatrix4_16: Matrix4.16 R45.1
NetMatrix4_17: Matrix4.17 R44.1
NetMatrix4_18: Matrix4.18 R43.1
NetMatrix4_19: Matrix4.19 R42.1
NetMatrix4_20: Matrix4.20 R41.1
NetMatrix5_5: Matrix5.5 R138.2
NetMatrix5_6: Matrix5.6 R139.2
NetMatrix5_7: Matrix5.7 R140.2
NetMatrix5_8: Matrix5.8 R141.2
NetMatrix5_9: Matrix5.9 R142.2
NetMatrix5_10: Matrix5.10 R143.2
NetMatrix5_11: Matrix5.11 R144.2
NetMatrix5_12: Matrix5.12 R145.2
NetMatrix5_13: Matrix5.13 R112.1
NetMatrix5_14: Matrix5.14 R111.1
NetMatrix5_15: Matrix5.15 R110.1
NetMatrix5_16: Matrix5.16 R109.1
NetMatrix5_17: Matrix5.17 R108.1
NetMatrix5_18: Matrix5.18 R107.1
NetMatrix5_19: Matrix5.19 R106.1
NetMatrix5_20: Matrix5.20 R105.1
NetMatrix6_5: Matrix6.5 R146.2
NetMatrix6_6: Matrix6.6 R147.2
NetMatrix6_7: Matrix6.7 R148.2
NetMatrix6_8: Matrix6.8 R149.2
NetMatrix6_9: Matrix6.9 R150.2
NetMatrix6_10: Matrix6.10 R151.2
NetMatrix6_11: Matrix6.11 R152.2
NetMatrix6_12: Matrix6.12 R153.2
NetMatrix6_13: Matrix6.13 R120.1
NetMatrix6_14: Matrix6.14 R119.1
NetMatrix6_15: Matrix6.15 R118.1
NetMatrix6_16: Matrix6.16 R117.1
NetMatrix6_17: Matrix6.17 R116.1
NetMatrix6_18: Matrix6.18 R115.1
NetMatrix6_19: Matrix6.19 R114.1
NetMatrix6_20: Matrix6.20 R113.1
NetMatrix7_5: Matrix7.5 R122.2
NetMatrix7_6: Matrix7.6 R123.2
NetMatrix7_7: Matrix7.7 R124.2
NetMatrix7_8: Matrix7.8 R125.2
NetMatrix7_9: Matrix7.9 R126.2
NetMatrix7_10: Matrix7.10 R127.2
NetMatrix7_11: Matrix7.11 R128.2
NetMatrix7_12: Matrix7.12 R129.2
NetMatrix7_13: Matrix7.13 R96.1
NetMatrix7_14: Matrix7.14 R95.1
NetMatrix7_15: Matrix7.15 R94.1
NetMatrix7_16: Matrix7.16 R93.1
NetMatrix7_17: Matrix7.17 R92.1
NetMatrix7_18: Matrix7.18 R91.1
NetMatrix7_19: Matrix7.19 R90.1
NetMatrix7_20: Matrix7.20 R89.1
NetMatrix8_5: Matrix8.5 R130.2
NetMatrix8_6: Matrix8.6 R131.2
NetMatrix8_7: Matrix8.7 R132.2
NetMatrix8_8: Matrix8.8 R133.2
NetMatrix8_9: Matrix8.9 R134.2
NetMatrix8_10: Matrix8.10 R135.2
NetMatrix8_11: Matrix8.11 R136.2
NetMatrix8_12: Matrix8.12 R137.2
NetMatrix8_13: Matrix8.13 R104.1
NetMatrix8_14: Matrix8.14 R103.1
NetMatrix8_15: Matrix8.15 R102.1
NetMatrix8_16: Matrix8.16 R101.1
NetMatrix8_17: Matrix8.17 R100.1
NetMatrix8_18: Matrix8.18 R99.1
NetMatrix8_19: Matrix8.19 R98.1
NetMatrix8_20: Matrix8.20 R97.1
NetR14_2: R14.2 U10.6(~{STDBY})
NetR15_2: R15.2 U10.7(~{CHRG})
NetR17_1: R17.1 U10.2(PROG)
NetR20_2: R20.2 U11.7(AUX_CL)
NetR21_2: R21.2 U11.6(AUX_DA)
NetR24_1: R24.1 R158.2 U9.5(FB)
NetR154_2: R154.2 U32.2(1A)
NetR155_1: R155.1 U32.12(4A)
NetR156_2: R156.2 U32.5(2A)
NetR157_1: R157.1 U32.9(3A)
NetR163_2: R163.2 R164.1 U10.1(TEMP)
NetR165_2: R165.2 U33.7(INL)
NetR166_1: R166.1 U11.9(AD0)
NetR167_2: R167.2 U33.10(INR)
NetSP1_1: SP1.1(+) U33.1(+OUT_L)
NetSP1_2: SP1.2(-) U33.3(-OUT_L)
NetSP2_1: SP2.1(+) U33.16(+OUT_R)
NetSP2_2: SP2.2(-) U33.14(-OUT_R)
NetU2_9: U2.9(QH') U4.14(DATA_IN)
NetU4_9: U4.9(QH') U5.14(DATA_IN)
NetU5_9: U5.9(QH') U6.14(DATA_IN)
NetU6_9: U6.9(QH') U7.14(DATA_IN)
NetU7_9: U7.9(QH') U8.14(DATA_IN)
NetU8_9: U8.9(QH') U12.14(DATA_IN)
NetU12_9: U12.9(QH') U13.14(DATA_IN)
NetU13_9: U13.9(QH') U14.14(DATA_IN)
NetU14_9: U14.9(QH') U16.14(DATA_IN)
NetU16_9: U16.9(QH') U17.14(DATA_IN)
NetU17_9: U17.9(QH') U18.14(DATA_IN)
NetU18_9: U18.9(QH') U19.14(DATA_IN)
NetU19_9: U19.9(QH') U20.14(DATA_IN)
NetU20_9: U20.9(QH') U21.14(DATA_IN)
NetU21_9: U21.9(QH') U22.14(DATA_IN)
NetU22_9: U22.9(QH') U23.14(DATA_IN)
NetU23_9: U23.9(QH') U24.14(DATA_IN)
NetU24_9: U24.9(QH') U26.14(DATA_IN)
NetU26_9: U26.9(QH') U27.14(DATA_IN)
NetU27_9: U27.9(QH') U28.14(DATA_IN)
NetU28_9: U28.9(QH') U29.14(DATA_IN)
NetU29_9: U29.9(QH') U30.14(DATA_IN)
NetU30_9: U30.9(QH') U31.14(DATA_IN)

Not connected (* = marked no-connect by the designer): CN1 A5(CC1)* A8(SBU1)* B5(CC2)* B8(SBU2)*; J3 2(Left_in)* 5(Right_in)*; SD1 P1(DAT2)* P8(DAT1)* P9(CD)* P10-1(P10)* P10-2(P10)* P10-3(P10)* P10-4(P10)*; SW1 3*; U1 13(IO19)* 14(IO20)* 16(IO46)* 26(IO45)* 28(IO35)* 29(IO36)* 30(IO37)* 31(IO38)* 32(IO39)* 33(IO40)* 34(IO41)* 35(IO42)*; U3 13(IO19)* 14(IO20)* 16(IO46)* 26(IO45)* 28(IO35)* 29(IO36)* 30(IO37)* 31(IO38)* 32(IO39)* 33(IO40)* 34(IO41)* 35(IO42)*; U9 6(SW)*; U10 9(EP)*; U11 2(NC)* 3(NC)* 4(NC)* 5(NC)* 12(INT)* 14(NC)* 15(NC)* 16(NC)* 17(NC)* 19(RESV)* 21(RESV)* 22(RESV)*; U31 9(QH')*; U34 9(~{CTS})* 10(~{DSR})* 11(~{RI})* 12(~{DCD})* 13(~{DTR})* 14(~{RTS})* 15(RS232)*

### Notes on the sheet
- BUTTON & JOYSTICK
- ESP32 (1)
- ESP32 (2)
- Matrix 1
- Matrix 2
- TYPE C SERIAL
- IO ESP32-1 OUTPUT
- (near J8) Serial1 (Esp32-2)
- IO ESP32-2 OUTPUT
- (near CN5) I2C
- (near CN4) Serial1 (Esp32-1)
- Matrix 3
- (ESP32-2)
- OLED DISPLAY
- MICRO
- AUDIO
- Matrix 4
- BATTERY CHARGE
- 3V3
- Matrix 5
- MATRIX DISPLAY
- (ESP32)
- Matrix 6
- ACCELERATION SENSOR
- SOUND AMPLI
- Matrix 7
- Matrix 8
- SD CARD
- (ESP8266)
- DWG. NO.
- REV.
- SHT.
- REVISION
- DESCRIPTION
- DATE
- APPROVED
- THIS DOCUMENT AND THE DATA DISCLOSED HEREIN OR HEREWITH IS THE PROPERTY OF ALTIUM LIMITED AND MAY BE FREELY DISTRIBUTED IN WHOLE. NO RIGHTS ARE RESERVED OR EXPRESS OR IMPLIED WARANTEE GIVEN.
- ENG:
- DSN:
- APPROVALS
- PROJECT
- DOCUMENT REVISION:
- DESIGN ITEM:
- CHK:
- BOM:
- REFERENCE DOCUMENTS
- PROJECT REVISION:
- TITLE
- FAB DWG:
- PCB DWG:
- ASSY DWG:
- SCALE:
- SIZE
- D
- CAGE CODE
- FILE NAME
- DWG NO.
- SHEET
- OF
- REV
- (in symbol Module MIC INMP441) INMP441; MIC

### Library data of the parts
C1 C2 C4 C7-C12 C14-C29 = Capacitor non-polar
C3 C5 C6 C13 = Capacitor polar
D1 D2 D4 D5 = Led Red
D3 = Led Green
D6 = Diode Schottky
D7-D10 = Diode
F1 F2 = Fuse
L1 = Inductor
R1-R167 = Resistor
X1 = Crytal